# Altium schematic sheet Adafruit PyGamer_0.SchDoc: Adafruit PyGamer
size 456 x 289 mm; COMPANY: ADAFRUIT INDUSTRIES; DRAWN: KTOWN; REV: B; Origin: Eagle; Date: 7/14/2023 9:01:12 AM; SheetNumber: 1; GateName_1: G$1; SymbolName_1: FRAME_A3_ADAFRUIT; LibraryName: microbuilder; DeviceSetName: FRAME_A3_ADAFRUIT; Sheet: Sheet:; AdafruitIndustries: Adafruit Industries
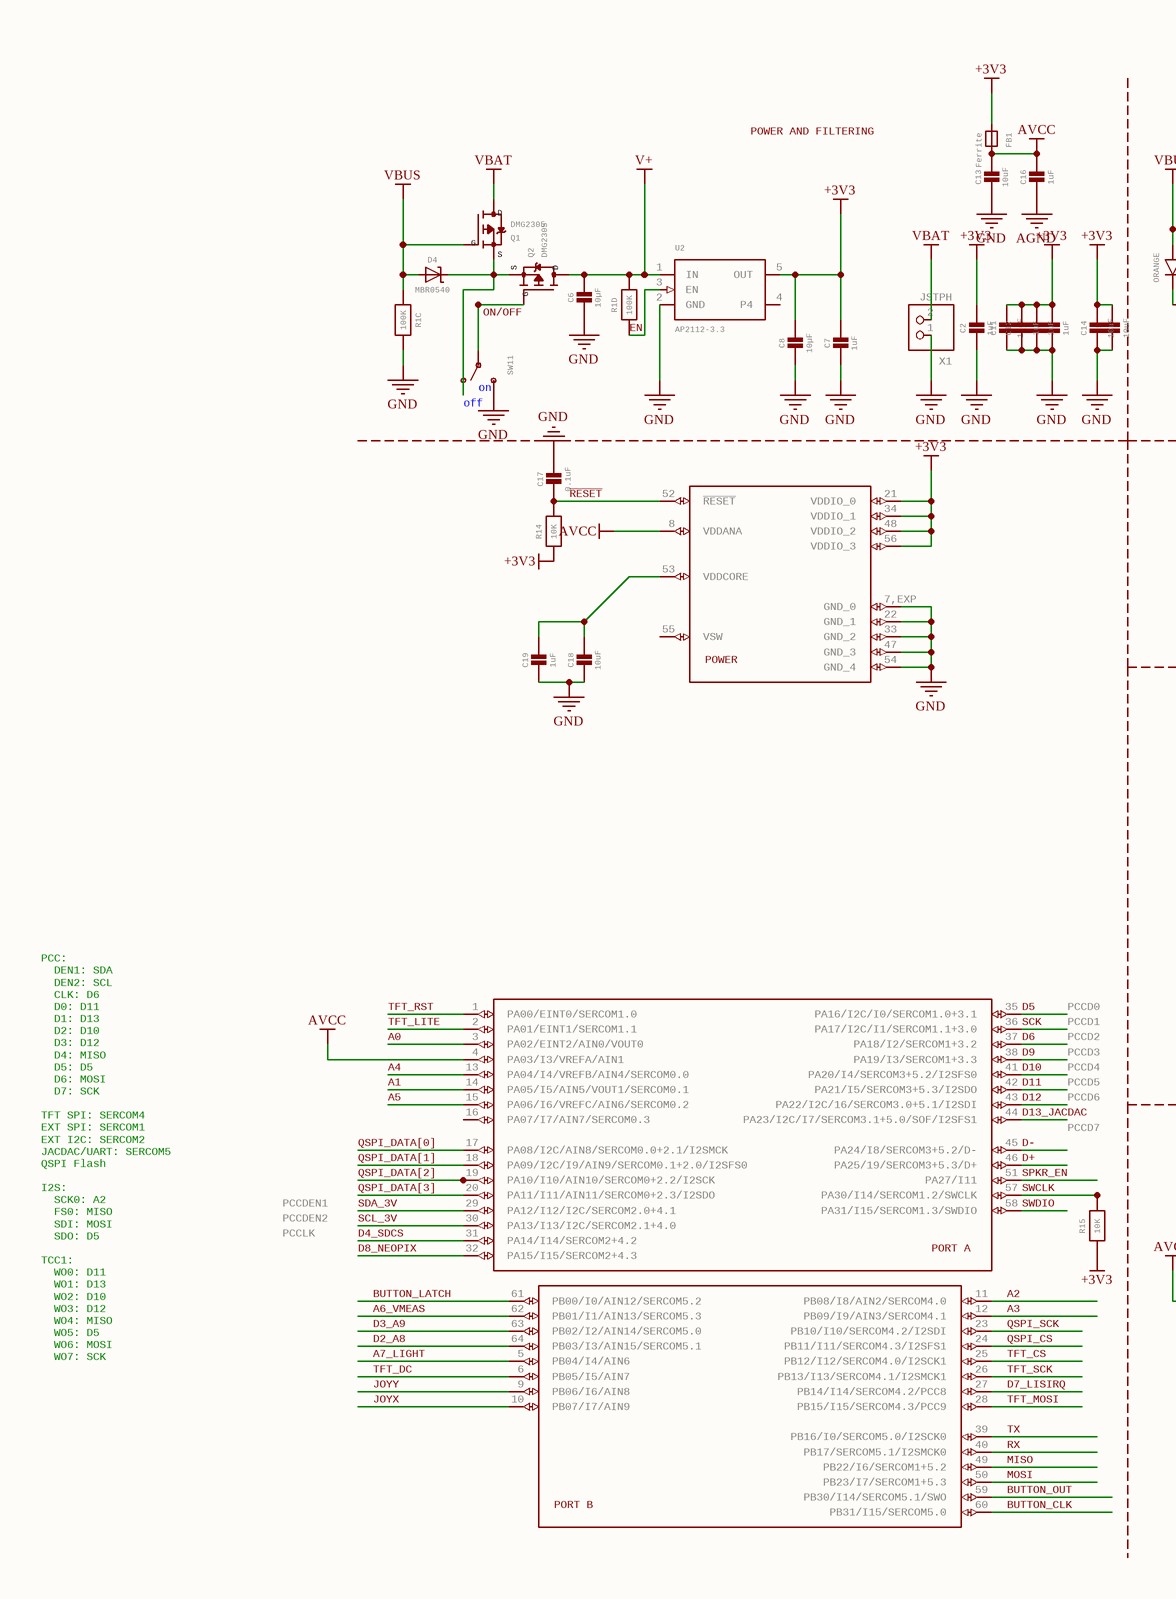
[diagram p0: Adafruit PyGamer_0.SchDoc, left]
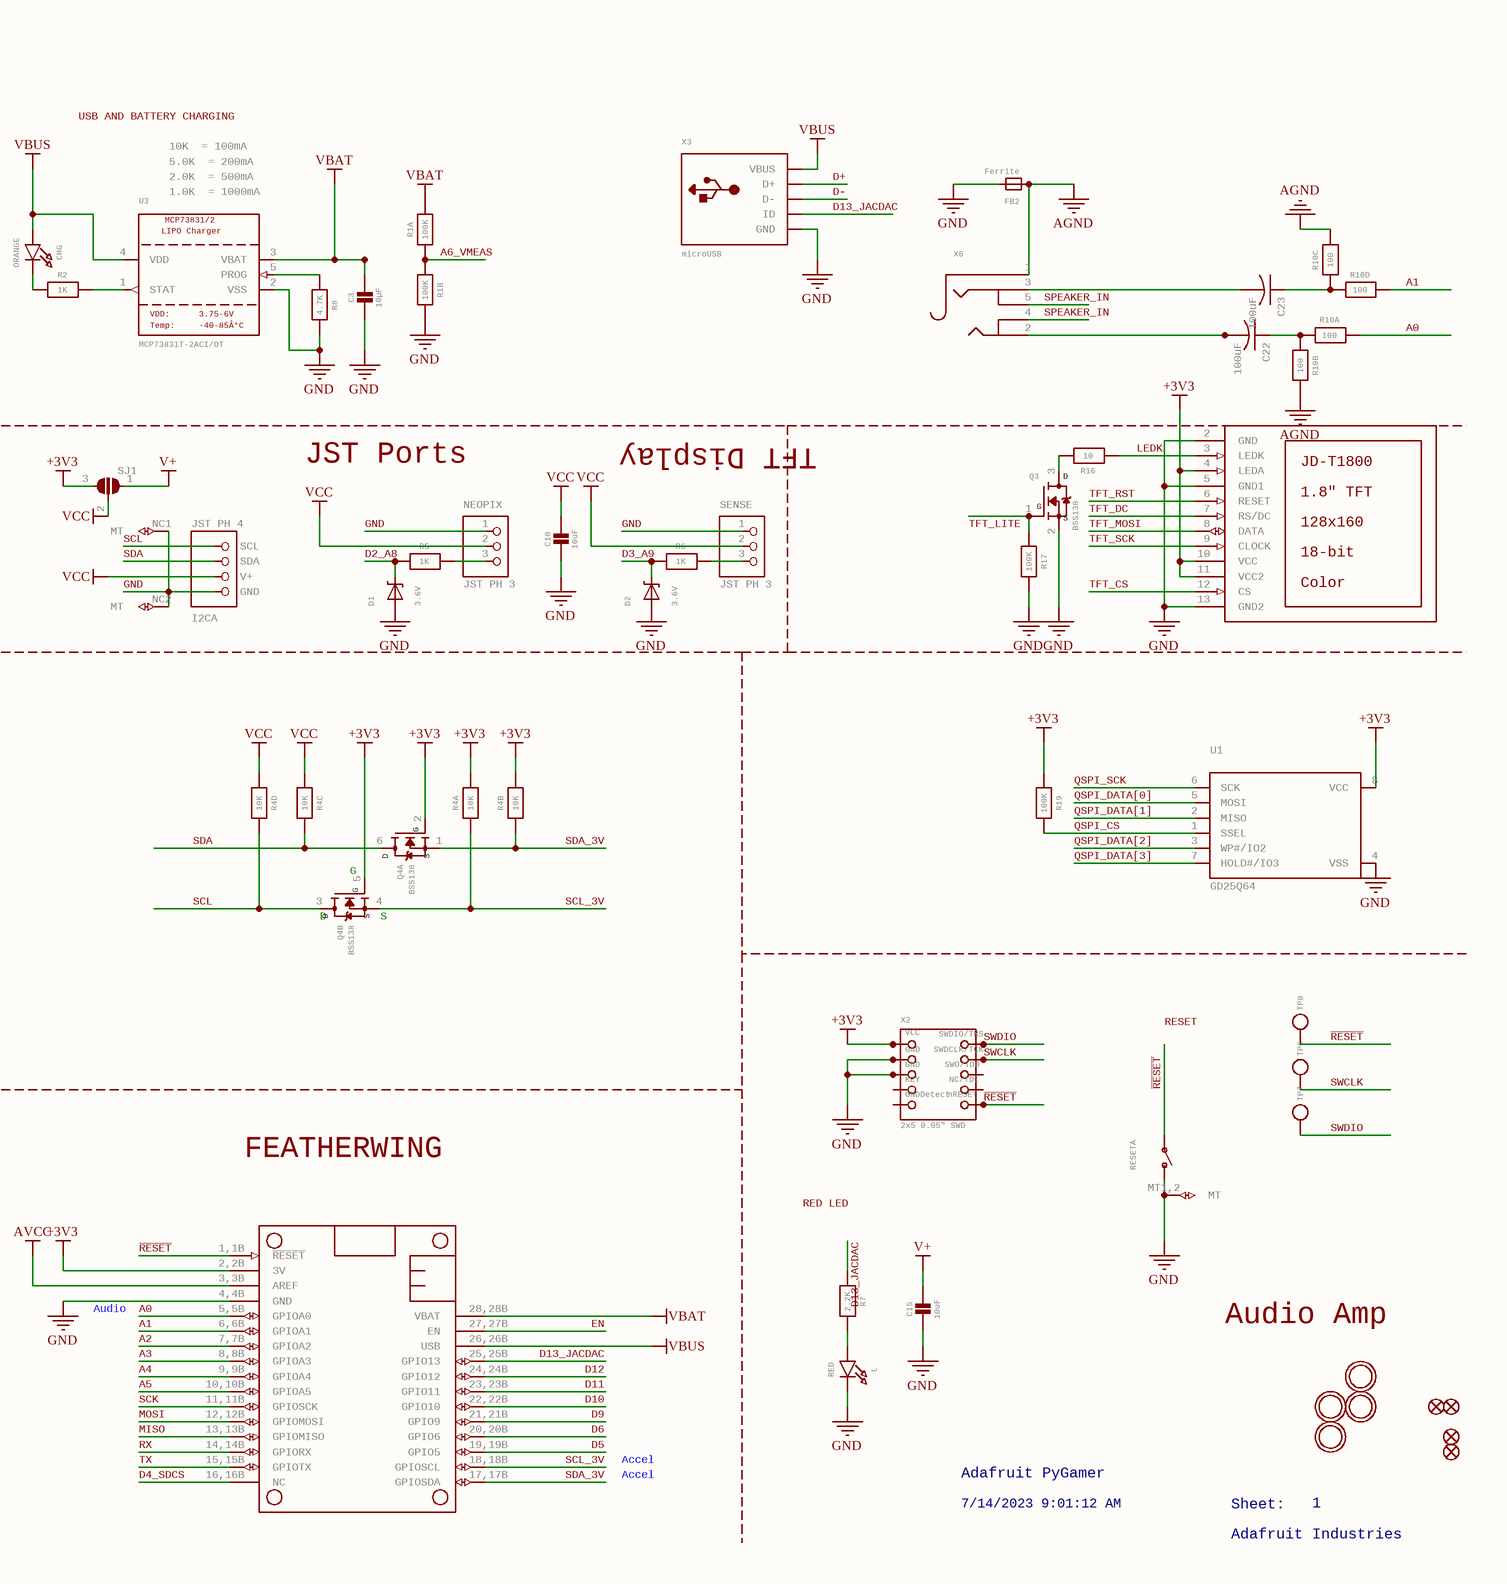
[diagram p1: Adafruit PyGamer_0.SchDoc, right]

## Parts
C1  1uF  [0603-NO]
C2  1uF  [0603-NO]
C3  10µF  [0805-NO]
C4  1uF  [0603-NO]
C5  10uF  [0805-NO]
C6  10µF  [0805-NO]
C7  1uF  [0603-NO]
C8  10µF  [0805-NO]
C10  10uF  [0805-NO]
C11  10uF  [0805-NO]
C12  1uF  [0603-NO]
C13  10uF  [0805-NO]
C14  10uF  [0805-NO]
C15  10uF  [0805-NO]
C16  1uF  [0603-NO]
C17  0.1uF  [0603-NO]
C18  10uF  [0805-NO]
C19  1uF  [0603-NO]
C22  100uF  [C1210]
C23  100uF  [C1210]
CHG  ORANGE  [CHIPLED_0805_NOOUTLINE]
D1  3.6V  [SOD-323]
D2  3.6V  [SOD-323]
D4  MBR0540  [SOD-123]
FB1  Ferrite  [0805-NO]
FB2  Ferrite  [_0805MP]
I2C  JST PH 4  [JSTPH4]  (parts A,B,C of 3)
L  RED  [CHIPLED_0805_NOOUTLINE]
LCD1  1.8"TFT: 1.8" TFT  [JD-T1800]  (hidden comment: DISP_LCD_JDT1800)
MS1  FEATHERWING_SMTDUALNOHOLES  [FEATHERWING_SMT_NOHOLES]  (value not drawn)
NEOPIX  JST PH 3  [JSTPH3]
Q1  DMG2305  [SOT23-R]
Q2  DMG2305  [SOT23-R]
Q3  BSS138  [SOT23-WIDE]
Q4  BSS138  [SOT363]  (parts A,B of 2)
R1  100K  [RESPACK_4X0603]  (parts A,B,C,D of 4)
R2  1K  [0603-NO]
R4  10K  [RESPACK_4X0603]  (parts A,B,C,D of 4)
R5  1K  [0603-NO]
R6  1K  [0603-NO]
R7  2.2K  [0603-NO]
R8  4.7K  [0603-NO]
R10  100  [RESPACK_4X0603]  (parts A,B,C,D of 4)
R14  10K  [0603-NO]
R15  10K  [0603-NO]
R16  10  [0603-NO]
R17  100K  [0603-NO]
R19  100K  [0603-NO]
RESET  SWITCH_SPST_TACT_RA  [SPST_TACTILE_RA]  (value not drawn)  (parts A,B of 2)
SENSE  JST PH 3  [JSTPH3]
SJ1  SOLDERJUMPER_2WAY  [SOLDERJUMPER_2WAY_OPEN_NOPASTE]  (value not drawn)
SW11  SWITCH_SPDT  [SPDT_SMT_SSSS811101]  (value not drawn)
TP6  TESTPOINTROUND2MMNO  [TESTPOINT_ROUND_2MM_NO]  (value not drawn)
TP7  TESTPOINTROUND2MMNO  [TESTPOINT_ROUND_2MM_NO]  (value not drawn)
TP8  TESTPOINTROUND2MMNO  [TESTPOINT_ROUND_2MM_NO]  (value not drawn)
U1  GD25Q64  [SOIC8_208MIL]
U2  AP2112-3.3  [SOT23-5]
U3  MCP73831T-2ACI/OT  LIPOCharger: LIPO Charger  Temp: Temp:  VDD: VDD:  [SOT23-5]
U$5  MOUNTINGHOLE3.0THIN  [MOUNTINGHOLE_3.0_PLATEDTHIN]  (value not drawn)
U$6  MOUNTINGHOLE3.0THIN  [MOUNTINGHOLE_3.0_PLATEDTHIN]  (value not drawn)
U$17  MOUNTINGHOLE3.0THIN  [MOUNTINGHOLE_3.0_PLATEDTHIN]  (value not drawn)
U$18  MOUNTINGHOLE3.0THIN  [MOUNTINGHOLE_3.0_PLATEDTHIN]  (value not drawn)
U$24  PORTA: PORT A  [PQFN64-1]  (hidden comment: ATSAMD51J19)  (parts A,B,C of 3)
U$34  FIDUCIAL_1MM  [FIDUCIAL_1MM]  (value not drawn)
U$35  FIDUCIAL_1MM  [FIDUCIAL_1MM]  (value not drawn)
U$43  FIDUCIAL_1MM  [FIDUCIAL_1MM]  (value not drawn)
U$46  FIDUCIAL_1MM  [FIDUCIAL_1MM]  (value not drawn)
X1  JSTPH  [JSTPH2]
X2  2x5 0.05" SWD  [2X05_1.27MM_BOX_POSTS]
X3  microUSB  [4UCONN_20329_V2]
X6  AUDIO_3.5MMJACK  [4UCONN_19269]  (value not drawn)

## Nets
+3V3: C1.1 C2.1 C4.1 C5.1 C7.1 C8.1 C11.1 C12.1 C14.1 FB1.1(P$1) LCD1.4(LEDA) LCD1.10(VCC) LCD1.11(VCC2) MS1.2,2B(3V) Q4.2(G) Q4.5(G) R4.1 R4.2 R14.1 R15.1 R19.1 SJ1.3 U1.8(VCC) U2.5(OUT) U$24.21(VDDIO_0) U$24.34(VDDIO_1) U$24.48(VDDIO_2) U$24.56(VDDIO_3) X2.1(VCC)
AGND: C16.2 FB2.1(P$1) R10.6 R10.7 X6.1(P$1)
AVCC: C13.1 C16.1 FB1.2(P$2) MS1.3,3B(AREF) U$24.4(PA03/I3/VREFA/AIN1) U$24.8(VDDANA)
GND: C1.2 C2.2 C3.2 C4.2 C5.2 C6.2 C7.2 C8.2 C10.2 C11.2 C12.2 C13.2 C14.2 C15.2 C17.1 C18.2 C19.2 D1.A D2.A FB2.2(P$2) I2C.1(GND) I2C.NC1(MT) I2C.NC2(MT) L.C LCD1.2(GND) LCD1.3(LEDK) LCD1.5(GND1) LCD1.13(GND2) MS1.4,4B(GND) NEOPIX.1 Q3.2(S) R1.6 R1.7 R8.2 R16.1 R17.2 RESET.2(S) RESET.MT1,2(MT) SENSE.1 SW11.C(S) U1.4(VSS) U2.2(GND) U3.2(VSS) U$24.7,EXP(GND_0) U$24.22(GND_1) U$24.33(GND_2) U$24.47(GND_3) U$24.54(GND_4) X1.1 X2.3(GND) X2.5(GND) X3.BASE@1,BASE@2,GND,SPRT@1,SPRT@2,SPRT@3,SPRT@4(GND)  [also labelled LEDK]
V+: C6.1 C15.1 Q2.3(D) R1.5 SJ1.1 U2.1(IN)
VBAT: C3.1 MS1.28,28B(VBAT) Q1.3(D) R1.8 U3.3(VBAT) X1.2
VBUS: CHG.A D4.A MS1.26,26B(USB) Q1.1(G) R1.3 U3.4(VDD) X3.VBUS
VCC: C10.1 I2C.2(V+) NEOPIX.2 R4.3 R4.4 SENSE.2 SJ1.2
A0: MS1.5,5B(GPIOA0) R10.8 U$24.3(PA02/EINT2/AIN0/VOUT0)
A1: MS1.6,6B(GPIOA1) R10.5 U$24.14(PA05/I5/AIN5/VOUT1/SERCOM0.1)
A2: MS1.7,7B(GPIOA2) U$24.11(PB08/I8/AIN2/SERCOM4.0)
A3: MS1.8,8B(GPIOA3) U$24.12(PB09/I9/AIN3/SERCOM4.1)
A4: MS1.9,9B(GPIOA4) U$24.13(PA04/I4/VREFB/AIN4/SERCOM0.0)
A5: MS1.10,10B(GPIOA5) U$24.15(PA06/I6/VREFC/AIN6/SERCOM0.2)
A6_VMEAS: R1.1 R1.2 U$24.62(PB01/I1/AIN13/SERCOM5.3)
A7_LIGHT: U$24.5(PB04/I4/AIN6)
BUTTON_CLK: U$24.60(PB31/I15/SERCOM5.0)
BUTTON_LATCH: U$24.61(PB00/I0/AIN12/SERCOM5.2)
BUTTON_OUT: U$24.59(PB30/I14/SERCOM5.1/SWO)
D2_A8: D1.C R5.2 U$24.64(PB03/I3/AIN15/SERCOM5.1)
D3_A9: D2.C R6.2 U$24.63(PB02/I2/AIN14/SERCOM5.0)
D4_SDCS: MS1.16,16B(NC) U$24.31(PA14/I14/SERCOM2+4.2)
D5: MS1.19,19B(GPIO5) U$24.35(PA16/I2C/I0/SERCOM1.0+3.1)
D6: MS1.20,20B(GPIO6) U$24.37(PA18/I2/SERCOM1+3.2)
D7_LISIRQ: U$24.27(PB14/I14/SERCOM4.2/PCC8)
D8_NEOPIX: U$24.32(PA15/I15/SERCOM2+4.3)
D9: MS1.21,21B(GPIO9) U$24.38(PA19/I3/SERCOM1+3.3)
D10: MS1.22,22B(GPIO10) U$24.41(PA20/I4/SERCOM3+5.2/I2SFS0)
D11: MS1.23,23B(GPIO11) U$24.42(PA21/I5/SERCOM3+5.3/I2SDO)
D12: MS1.24,24B(GPIO12) U$24.43(PA22/I2C/16/SERCOM3.0+5.1/I2SDI)
D13_JACDAC: MS1.25,25B(GPIO13) R7.1 U$24.44(PA23/I2C/I7/SERCOM3.1+5.0/SOF/I2SFS1) X3.ID
D+: U$24.46(PA25/19/SERCOM3+5.3/D+) X3.D+
D-: U$24.45(PA24/I8/SERCOM3+5.2/D-) X3.D-
EN: MS1.27,27B(EN) R1.4 U2.3(EN)
JOYX: U$24.10(PB07/I7/AIN9)
JOYY: U$24.9(PB06/I6/AIN8)
MISO: MS1.13,13B(GPIOMISO) U$24.49(PB22/I6/SERCOM1+5.2)
MOSI: MS1.12,12B(GPIOMOSI) U$24.50(PB23/I7/SERCOM1+5.3)
ON/OFF: Q2.1(G) SW11.B(P)
QSPI_CS: R19.2 U1.1(SSEL) U$24.24(PB11/I11/SERCOM4.3/I2SFS1)
QSPI_DATA[0]: U1.5(MOSI) U$24.17(PA08/I2C/AIN8/SERCOM0.0+2.1/I2SMCK)
QSPI_DATA[1]: U1.2(MISO) U$24.18(PA09/I2C/I9/AIN9/SERCOM0.1+2.0/I2SFS0)
QSPI_DATA[2]: U1.3(WP#/IO2) U$24.19(PA10/I10/AIN10/SERCOM0+2.2/I2SCK)
QSPI_DATA[3]: U1.7(HOLD#/IO3) U$24.20(PA11/I11/AIN11/SERCOM0+2.3/I2SDO)
QSPI_SCK: U1.6(SCK) U$24.23(PB10/I10/SERCOM4.2/I2SDI)
~{RESET}: C17.2 MS1.1,1B(~{RESET}) R14.2 RESET.1(P) TP8.P$1 U$24.52(~{RESET}) X2.10(NRESET)
RX: MS1.14,14B(GPIORX) U$24.40(PB17/SERCOM5.1/I2SMCK0)
SCK: MS1.11,11B(GPIOSCK) U$24.36(PA17/I2C/I1/SERCOM1.1+3.0)
SCL: I2C.4(SCL) Q4.3(D) R4.5
SCL_3V: MS1.18,18B(GPIOSCL) Q4.4(S) R4.8 U$24.30(PA13/I13/I2C/SERCOM2.1+4.0)
SDA: I2C.3(SDA) Q4.6(D) R4.6
SDA_3V: MS1.17,17B(GPIOSDA) Q4.1(S) R4.7 U$24.29(PA12/I12/I2C/SERCOM2.0+4.1)
SPEAKER_IN: X6.4(P$4) X6.5(P$3)
SPKR_EN: U$24.51(PA27/I11)
SWCLK: R15.2 TP6.P$1 U$24.57(PA30/I14/SERCOM1.2/SWCLK) X2.4(SWDCLK)
SWDIO: TP7.P$1 U$24.58(PA31/I15/SERCOM1.3/SWDIO) X2.2(SWDIO)
TFT_CS: LCD1.12(CS) U$24.25(PB12/I12/SERCOM4.0/I2SCK1)
TFT_DC: LCD1.7(RS/DC) U$24.6(PB05/I5/AIN7)
TFT_LITE: Q3.1(G) R17.1 U$24.2(PA01/EINT1/SERCOM1.1)
TFT_MOSI: LCD1.8(DATA) U$24.28(PB15/I15/SERCOM4.3/PCC9)
TFT_RST: LCD1.6(RESET) U$24.1(PA00/EINT0/SERCOM1.0)
TFT_SCK: LCD1.9(CLOCK) U$24.26(PB13/I13/SERCOM4.1/I2SMCK1)
TX: MS1.15,15B(GPIOTX) U$24.39(PB16/I0/SERCOM5.0/I2SCK0)
NetC18_1: C18.1 C19.1 U$24.53(VDDCORE)
NetC22_1: C22.1 R10.1 R10.2
NetC22_2: C22.2 X6.2(P$5)
NetC23_1: C23.1 R10.3 R10.4
NetC23_2: C23.2 X6.3(P$2)
NetCHG_C: CHG.C R2.1
NetD4_C: D4.C Q1.2(S) Q2.2(S) SW11.A(O)
NetL_A: L.A R7.2
NetNEOPIX_3: NEOPIX.3 R5.1
NetQ3_3: Q3.3(D) R16.2
NetR2_2: R2.2 U3.1(STAT)
NetR6_1: R6.1 SENSE.3
NetR8_1: R8.1 U3.5(PROG)

Not connected (* = marked no-connect by the designer): U2 4(P4); U$24 16(PA07/I7/AIN7/SERCOM0.3) 55(VSW); X2 6(SWO) 7(KEY) 8(TDI) 9(GNDDETECT)

## Notes on the sheet
- POWER AND FILTERING
- USB AND BATTERY CHARGING
- 10K  = 100mA
- 5.0K  = 200mA
- 2.0K  = 500mA
- 1.0K  = 1000mA
- (near SW11) off
- (near SW11) on
- TFT Display
- JST Ports
- (near Q4) G
- (near Q4) D
- (near Q4) S
- PCCD0
- PCCD1
- PCCD2
- PCCD3
- RESET
- PCCD4
- PCCD5
- PCCD6
- PCCD7
- PCCDEN1
- FEATHERWING
- PCCDEN2
- PCCLK
- RED LED
- PCC:
  DEN1: SDA
  DEN2: SCL
  CLK: D6
  D0: D11
  D1: D13
  D2: D10
  D3: D12
  D4: MISO
  D5: D5
  D6: MOSI
  D7: SCK
  TFT SPI: SERCOM4
  EXT SPI: SERCOM1
  EXT I2C: SERCOM2
  JACDAC/UART: SERCOM5
  QSPI Flash
  I2S:
  SCK0: A2
  FS0: MISO
  SDI: MOSI
  SDO: D5
  TCC1:
  WO0: D11
  WO1: D13
  WO2: D10
  WO3: D12
  WO4: MISO
  WO5: D5
  WO6: MOSI
  WO7: SCK
- Audio
- (near U$17) Audio Amp
- Accel
- Adafruit PyGamer
- 7/14/2023 9:01:12 AM
- Sheet:
- Adafruit Industries
- 1

## Library data of the parts
C1 C2 C4 C7 C12 C16 C17 C19 = CAP_CERAMIC0603_NO: Ceramic Capacitors   For new designs, use the packages preceded by an '_' character since they are more reliable:   The following footprints should be used on most boards: _0402 - Standard footprint for regular board layouts  _0603 - Standard footprint for regular board layouts  _0805 - Standard footprint for regular board layouts  _1206 - Standard footprint for regular board layouts       For extremely tight-pitch boards where space is at a premium, the following 'micro-pitch' footprints can be used (smaller pads, no silkscreen outline, etc.): _0402MP - Micro-pitch footprint for very dense/compact boards  _0603MP - Micro-pitch footprint for very dense/compact boards  _0805MP - Micro-pitch footprint for very dense/compact boards  _1206MP - Micro-pitch footprint for very dense/compact boards; GateName_1: G$1; SymbolName_1: CAPACITOR; DeviceName: 0603_NO; LibraryName: microbuilder; DeviceSetName: CAP_CERAMIC
C3 C5 C6 C8 C10 C11 C13-C15 C18 = CAP_CERAMIC0805-NOOUTLINE: Ceramic Capacitors   For new designs, use the packages preceded by an '_' character since they are more reliable:   The following footprints should be used on most boards: _0402 - Standard footprint for regular board layouts  _0603 - Standard footprint for regular board layouts  _0805 - Standard footprint for regular board layouts  _1206 - Standard footprint for regular board layouts       For extremely tight-pitch boards where space is at a premium, the following 'micro-pitch' footprints can be used (smaller pads, no silkscreen outline, etc.): _0402MP - Micro-pitch footprint for very dense/compact boards  _0603MP - Micro-pitch footprint for very dense/compact boards  _0805MP - Micro-pitch footprint for very dense/compact boards  _1206MP - Micro-pitch footprint for very dense/compact boards; GateName_1: G$1; SymbolName_1: CAPACITOR; DeviceName: 0805-NOOUTLINE; LibraryName: microbuilder; DeviceSetName: CAP_CERAMIC
  C8: REV: C
C22 C23 = C-USC1210: CAPACITOR, American symbol; GateName_1: G$1; SymbolName_1: C-US-1; DeviceSetName: C-US; DeviceName: C1210; LibraryName: resistor
CHG L = LED0805_NOOUTLINE: LED0603 - 0603 Surface Mount Package    2mA: Green LED - Low Power (3.9mcd, 2ma, 1.7Vf) - Digikey: 475-2709-2-ND  Orange LED - Low Power (9.8mcd, 2ma, 1.8Vf) - Digikey: 475-1194-2-ND  Red LED - Low Power (5mcd, 2ma, 1.8Vf) - Digikey: 475-1195-2-ND  Yellow LED - Low Power (7mcd, 2ma, 1.8Vf) - Digikey: 475-1196-2-ND       5mA: Blue LED - Low Power (17mcd, 5ma, 2.9Vf) - Digikey: LNJ937W8CRACT-ND    0805 - 0805 Surface Mount Package    2mA: Red LED (8.8mcd, 2mA, 1.8Vf, Clear) - Low Power [Digikey: 475-2510-1-ND]  Green LED (5mcd, 2mA, 1.8Vf, Clear) - Low Power [Digikey: 475-2730-1-ND]  Yellow LED (11.3mcd, 2mA, 1.8Vf, Clear) - Low Power [Digikey: 475-2555-1-ND]       20mA: Red LED (104mcd, 20mA, Diffused) - LS R976 [Digikey: 475-1278-6-ND]  Red LED (12mcd, 20mA, 2.0Vf, Clear) - APT2012EC [Digikey: 754-1128-1-ND]  Green LED (15mcd, 20mA, 2.2Vf, Clear) - APT2012GC [Digikey: 754-1131-1-ND]  Orange LED (160mcd, 20mA, 2.1Vf, Clear) - APT2012SECK [Digikey: 754-1130-1-ND]     1206 - 1206 Surface Mount Package  Green LED (26mcd, 20mA, Diffused) - LG N971  [Digikey: 475-1407-6-ND]  Red LED (15mcd, 20mA, Diffused) - LH N974 [Digikey: 475-1416-6-ND]     Cree - Cree High-Power Surface Mount LEDs  XPEBWT-L1-0000-00D50 - White 111lm 350mA 2.9Vf 6200K 110Â°  XTEAWT-00-0000-00000LEE3 - White 114lm 350mA 2.85Vf 5000K 115Â°     Everlight - Everlight 45-21 Series Surface Mount LEDs  45-21/QK2C-B2832AC2CB2/2T - Warm White 2000mcd 20mA 3.25Vf 3050K 120Â°  45-21/LK2C-B38452C4CB2/2T - Nuetral White 2000mcd 20mA 3.25Vf 4150K 120Â°  45-21/LK2C-B50634C6CB2/2T - Cold White 2200mcd 20mA 3.25Vf 5650K 120Â°     PLCC2 Reverse Mount LS T77K-J1L2-1-0-2-R18-Z - Red 11.25mcd 2mA 1.8Vf 630nm 120Â°  LO T77K-L1M2-24-Z - Orange 19.6mcd 2mA 1.8Vf 606nm 120Â°  LY T77K-K2M1-26-Z - Yellow 15.7mcd 2mA 1.8Vf 587nm 120Â°; GateName_1: G$1; SymbolName_1: LED; DeviceName: 0805_NOOUTLINE; LibraryName: microbuilder; DeviceSetName: LED
D1 D2 = DIODE-ZENERSOD323: Zener Diode   SMA: 30V 1W Zener Diode, 1.2Vf - Digikey: SMAZ30-FDICT-ND; GateName_1: G$1; DeviceName: SOD323; SymbolName_1: DIODE-ZENER; LibraryName: microbuilder; DeviceSetName: DIODE-ZENER
D4 = DIODE-SCHOTTKYSOD-123: GateName_1: G$1; SymbolName_1: DIODE-SCHOTTKY; DeviceName: SOD-123; LibraryName: microbuilder; DeviceSetName: DIODE-SCHOTTKY
FB1 = FERRITE-0805NO: Ferrite Bead   0603 MMZ1608B121C - 120 Ohm @ 100MHz, 600mA, 0.15 Ohm DC Resistance - Digikey: 445-2164-1-ND  BK1608HW121-T - 120 Ohm, 600mA Ferrite Chip - Digikey: 587-1876-2-ND       0805 HZ0805B272R-10 - 2.7K Ohm @ 100MHz, 200mA, 0.8 Ohm DC Resistance - Digikey: 240-2504-1-ND (see also Murata BLM21BD272SN1L)  MMZ2012Y152B - 1.5K Ohm @ 100MHz, 500mA, 0.4 Ohm DC Resistance - Digikey: 445-1560-1-ND - Mainly for high frequency (80-400MHz)  MMZ2012R102A - 1K Ohm @ 100MHz, 500mA, 0.3 Ohm DC Resistance - Digikey: 445-1555-2-ND - More general purpose (10-200MHz); GateName_1: G$1; SymbolName_1: FERRITE; DeviceName: -0805NO; LibraryName: microbuilder; DeviceSetName: FERRITE
FB2 = FERRITE_0805MP: Ferrite Bead   0603 MMZ1608B121C - 120 Ohm @ 100MHz, 600mA, 0.15 Ohm DC Resistance - Digikey: 445-2164-1-ND  BK1608HW121-T - 120 Ohm, 600mA Ferrite Chip - Digikey: 587-1876-2-ND       0805 HZ0805B272R-10 - 2.7K Ohm @ 100MHz, 200mA, 0.8 Ohm DC Resistance - Digikey: 240-2504-1-ND (see also Murata BLM21BD272SN1L)  MMZ2012Y152B - 1.5K Ohm @ 100MHz, 500mA, 0.4 Ohm DC Resistance - Digikey: 445-1560-1-ND - Mainly for high frequency (80-400MHz)  MMZ2012R102A - 1K Ohm @ 100MHz, 500mA, 0.3 Ohm DC Resistance - Digikey: 445-1555-2-ND - More general purpose (10-200MHz); GateName_1: G$1; SymbolName_1: FERRITE; DeviceName: _0805MP; LibraryName: microbuilder; DeviceSetName: FERRITE
I2C = STEMMA_I2C_RASMT: GateName_1: G$1; GateName_2: G$2; SymbolName_2: MOUNTING; GateName_3: G$3; DeviceName: _RASMT; SymbolName_1: STEMMA_I2C; SymbolName_3: MOUNTING; LibraryName: microbuilder; DeviceSetName: STEMMA_I2C
LCD1 = DISP_LCD_JDT1800: GateName_1: G$1; SymbolName_1: JD-T1800; LibraryName: microbuilder; DeviceSetName: DISP_LCD_JDT1800; JD-T1800: JD-T1800; 128x160: 128x160; 18-bit: 18-bit; Color: Color
MS1 = FEATHERWING_SMTDUALNOHOLES: GateName_1: G$1; SymbolName_1: MICROSHIELD; DeviceName: _SMTDUALNOHOLES; LibraryName: microbuilder; DeviceSetName: FEATHERWING
NEOPIX SENSE = CON_JST_PH_3PIN: GateName_1: G$1; SymbolName_1: PINHD3; LibraryName: microbuilder; DeviceSetName: CON_JST_PH_3PIN
Q1 Q2 = MOSFET-P: P-Channel Mosfet   LEGEND   VDS: Voltage Drain-Source ID: Drain Current RDS(ON): Drain-Source On-State Resistance VGS(TH): Gate-Source Threshold Voltage CISS: Drain-Source Input Capacitance    SOT-23   Name	VDS	ID	RDS(ON)	VGS(TH)	CISS	Order Number	   IRLML5103	30V	760mA	600 mOhm	--	75pF @ 25V	Digikey: IRLML5103PBFCT-ND	   IRLML6401	12V	4.3A	50 mOhm	950mV @ 250ÂµA	830pF @ 10V	Digikey: IRLML6401PBFTR-ND	   NTR0202PL	20V	400mA	800 mOhm	2.3V @ 250uA	70pF @ 5V	Digikey: NTR0202PLT1GOSTR-ND	   NTR4101PT1G	20V	1.8A	85 mOhm	1.2V @ 250uA	675pF @ 10V	Digikey: NTR4101PT1GOSCT-ND	   DMP2004K	20V	600mA	900 mOhm	1V @ 250uA	175pF @ 16V	Digikey: DMP2004KDICT-ND	   PMV65XP	20V	3.9A	76 mOhm	950mV @ 1mA	725pF @ 20V	Digikey: 568-2358-2-ND	   							   							TO-252   Name	VDS	ID	RDS(ON)	VGS(TH)	CISS	Order Number	   AOD417	30V	25A	34 mOhm	3V @ 250ÂµA	920pF @ 15V	Digikey: 785-1106-2-ND	PowerPak   Name	VDS	ID	RDS(ON)	VGS(TH)	CISS	Order Number	   AON7401	30V	12A	14 mOhm	3V @ 250ÂµA	2600pF @ 15V	Digikey: 785-1302-1-ND; GateName_1: G$1; SymbolName_1: MOSFET-P; LibraryName: microbuilder; DeviceSetName: MOSFET-P; D: D; S: S; G: G
Q3 = MOSFET-NWIDE: N-Channel Mosfet   LEGEND   VDS: Voltage Drain-Source ID: Drain Current RDS(ON): Drain-Source On-State Resistance VGS(TH): Gate-Source Threshold Voltage CISS: Drain-Source Input Capacitance    SOT-23   Name	VDS	ID	RDS(ON)	VGS(TH)	CISS	Order Number	   2N7002E	60V	260mA	2.5 Ohm	2.5V @ 250uA	26.7pF @ 25V	2N7002ET1GOSTR-ND	   BSH103	30V	850mA	400 mOhm	400mV @ 1mA	83pF @ 24V	BSH103,235-ND	   BSS138	60V	320mA	1.6 Ohm	1.5V @ 250uA	50pF @ 10V	Mouser: 771-BSS138PW115	   DMN2075U-7	20V	4.2A	38 mOhm	1V @ 250 uA	594.3pF @ 10V	DMN2075U-7DICT-ND	   							   * BSS138 good choice for I2C level-shifting   POWERPAK 1212-8   Name	VDS	ID	RDS(ON)	VGS(TH)	CISS	Order Number	   Si7308DN	60V	6A	58 mOhm	3V @ 250uA	665pF @ 15V	SI7308DN-T1-E3CT-ND; GateName_1: G$1; DeviceName: WIDE; SymbolName_1: MOSFET-N; LibraryName: microbuilder; DeviceSetName: MOSFET-N; D: D; S: S; G: G
Q4 = MOSFET-N_DUAL: Dual N-Channel MOSFET   SOT363 (2.0x1.25mm) 2N7002PS - 60V, 320mA [Digikey: 568-5984-1-ND]; GateName_1: 1; GateName_2: 2; SymbolName_1: MOSFET-N; SymbolName_2: MOSFET-N; LibraryName: microbuilder; DeviceSetName: MOSFET-N_DUAL; D: D; S: S; G: G
R1 R4 R10 = RESISTOR_4PACK: Resistor Packs (4 resistors)   4 x 0603 10K 1/16W - Digikey: YC164J-10KCT-ND; GateName_1: G$1; GateName_2: G$2; GateName_3: G$3; GateName_4: G$4; SymbolName_1: RESISTOR; SymbolName_2: RESISTOR; SymbolName_3: RESISTOR; SymbolName_4: RESISTOR; LibraryName: microbuilder; DeviceSetName: RESISTOR_4PACK
R2 R5-R8 R14-R17 R19 = RESISTOR_0603_NOOUT: Resistors   For new designs, use the packages preceded by an '_' character since they are more reliable:   The following footprints should be used on most boards: _0402 - Standard footprint for regular board layouts  _0603 - Standard footprint for regular board layouts  _0805 - Standard footprint for regular board layouts  _1206 - Standard footprint for regular board layouts       For extremely tight-pitch boards where space is at a premium, the following 'micro-pitch' footprints can be used (smaller pads, no silkscreen outline, etc.): _0402MP - Micro-pitch footprint for very dense/compact boards  _0603MP - Micro-pitch footprint for very dense/compact boards  _0805MP - Micro-pitch footprint for very dense/compact boards  _1206MP - Micro-pitch footprint for very dense/compact boards; GateName_1: G$1; SymbolName_1: RESISTOR; DeviceName: _0603_NOOUT; LibraryName: microbuilder; DeviceSetName: RESISTOR
RESET = SWITCH_SPST_TACT_RA: Switch - SPST 4UCon 19192 (6.7x2.6mm SMT); GateName_1: G$1; GateName_2: G$2; SymbolName_2: MOUNTING; SymbolName_1: SWITCH_SPST; DeviceName: _TACT_RA; LibraryName: microbuilder; DeviceSetName: SWITCH_SPST
SJ1 = SOLDERJUMPER_2WAY: 2-Way Solder Jumper; GateName_1: G$1; SymbolName_1: SOLDERJUMPER_2WAY; LibraryName: microbuilder; DeviceSetName: SOLDERJUMPER_2WAY
SW11 = SWITCH_SPDT: Switch - SPDT SSSS811101 - Horizontal Two Position SMT, 0.3A 4V [Mouser: 688-SSSS811101]; GateName_1: G$1; SymbolName_1: SWITCH_SPDT; LibraryName: microbuilder; DeviceSetName: SWITCH_SPDT
TP6-TP8 = TESTPOINTROUND2MMNO: Test Point   Various test points for characterisation and PCB testing    TESTPOINT_SMT - Compact Surface Mount Test Point [Digikey: 5016KTR-ND]; GateName_1: G$1; SymbolName_1: TESTPOINT; DeviceName: ROUND2MMNO; LibraryName: microbuilder; DeviceSetName: TESTPOINT
U1 = SPIFLASH_8PIN208MIL: SOIC8 SPI Flash   Be careful with the size since SOIC8 flash comes in several 'widths'   SOIC8 150 mil M25P16 - 16Mbit (2Mbit x 8) Serial Flash (75MHz SPI Bus), Supply: 2.7-3.6V  Digikey:  SOIC8 - M25P16-VMN6P-ND       SOIC8 208 mil W25Q16BVSSIG - 16Mbit (2Mbit x 8) Serial Flash (104MHz SPI Bus), Supply: 2.7-3.6V  Digikey:  SOIC8 - W25Q16BVSSIG-ND; GateName_1: G$1; DeviceName: 208MIL; SymbolName_1: M25P16; LibraryName: microbuilder; DeviceSetName: SPIFLASH_8PIN
U2 = VREG_SOT23-5: SOT23-5 Fixed Voltage Regulators      Part	Current Out	V Out	V In	V Dropout	Î¸JA (Â°C/W)	TJ (Â°C)	Digikey Part No.	     ADP121	  150mA	  3.3V	  3.4-5.5V	  0.09V @ 150mA	  --	  --	  ADP121-AUJZ33R7CT-ND	     ADP121	  150mA	  3.0V	  3.1-5.5V	  0.09V @ 150mA	  --	  --	  ADP121-AUJZ30R7CT-ND	     ADP122	  300mA	  3.3V	  3.4-5.5V	  0.085V @ 300mA	  --	  --	  ADP122AUJZ-3.3-R7CT-ND	     ADP1712	  300mA	  3.3V	  3.5-5.5V	  0.17V @ 300mA	  --	  --	  ADP1712AUJZ-3.3-R7TR-ND	     AP7311 (Low Cost)	  150mA	  3.3V	  3.5-6V	  0.15V @ 150mA	  --	  --	  AP7311-33WG-7DICT-ND	     LD39015M18R	  150mA	  1.8V	  1.9V-5.5V	  0.08V @ 100mA	  --	  --	  497-6977-1-ND	     LP2985A-33DBVR	  150mA	  3.3V	  3.3-16V	  0.28V @ 150mA	  206	  150	  296-18479-1-ND	     MCP1824T-3302E/OT	  300mA	  3.3V	  3.5V-6V	  0.2V @ 300mA	  --	  --	  MCP1824T-3302E/OTCT-ND	     MIC5205-2.5YM5 TR	  150mA	  2.5V	  2.7-16V	  0.165V @ 150mA	  --	  --	  576-1257-2-ND	     MIC5205-3.0YM5 TR	  150mA	  3.0V	  3.2V-16V	  0.165V @ 150mA	  --	  --	  576-1258-2-ND	     MIC5205-3.3YM5 TR	  150mA	  3.3V	  3.5V-16V	  0.165V @ 150mA	  --	  --	  576-1259-2-ND	     TPS780330220	  150mA	  3.3V+2.2V	  3.6-5.5V	  250mV Max	  --	  --	  296-23332-1-ND	     TDA3663/N1,135	  100mA	  3.3V	  3.5-45V	  0.18V @ 50mA	  --	  --	  568-5343-1-ND	     	  	  	  	  	  	  	  	     	  	  	  	  	  	  	  	   Max operating temp can be calculated using Î¸JA, TJ (max junction temperature), and power in watts.  Set the "Maximum Ambient Temperature" until it reaches TJ ("Max Junction Temperature"), which is the absolute limit for safe use of the regulator: Heat Sink Temperature Calculator   For example, With 12V source into a 3.3V LP2985 and a 30mA load, we are dissipating (12V-3.3V) * 0.03A = 0.261W.  With a Î¸JA of 206 Â°C/W, a TJ of 150Â°C, and 261mW we can safely use the chip without a heat sink up to 75Â°C (=147.1Â°C Junction Temperature).; GateName_1: G$1; SymbolName_1: VREG_SOT23-5; LibraryName: microbuilder; DeviceSetName: VREG_SOT23-5
U3 = MCP73831/2: MCP73831/2 LIPO Charger    VDD: 3.75 - 6V  Temp -40 - 85Â°C  Programmable Charge Rate: 15-500mA       NOTE: STAT is a tri-state logic output on the MCP73831 and an open-drain output on the MCP73832.   SOT23-5 with 4.2V output and tri-state logic on STAT = MCP73831T-2ACI/OT; GateName_1: G$1; SymbolName_1: MCP73831/2; LibraryName: microbuilder; DeviceSetName: MCP73831/2; MCP73831/2: MCP73831/2; -40-85Â°C: -40-85Â°C; 3.75-6V: 3.75-6V
U$5 U$6 U$17 U$18 = MOUNTINGHOLE3.0THIN: Mounting Hole   For #2 screws (0.086"/2.18mm width, 0.094"/2.4mm hole) use 2.5mm; GateName_1: G$1; BOM: EXCLUDE; SymbolName_1: MOUNTINGHOLE; DeviceName: 3.0THIN; LibraryName: microbuilder; DeviceSetName: MOUNTINGHOLE
U$24 = ATSAMD51J: ATSAMD51J cortex m4 microcontroller; GateName_1: G$1; SymbolName_1: ATSAMD51J_PORTA; GateName_2: G$2; SymbolName_2: ATSAMD51J_PORTB; GateName_3: G$3; SymbolName_3: ATSAMD51J_PWR; LibraryName: microbuilder; DeviceSetName: ATSAMD51J
U$34 U$35 U$43 U$46 = FIDUCIAL_1MM: Fiducial Alignment Points   Various fiducial points for machine vision alignment.; GateName_1: G$1; DeviceName: _1MM; BOM: EXCLUDE; SymbolName_1: FIDUCIAL; LibraryName: microbuilder; DeviceSetName: FIDUCIAL
X1 = CON_JST_PH_2PIN: JST 2-Pin Right-Angle Connector  PH-Series - 4UConnector: 17311  SH-Series - 4UConnector: 07278; GateName_1: G$1; SymbolName_1: PINHD2; LibraryName: microbuilder; DeviceSetName: CON_JST_PH_2PIN
X2 = JTAG-CORTEXBOXPOSTS: Serial Wire (SW-DP) Connector   Standard 0.05" 10-pin connector is for use with the Cortex M and Cortex A SWD (serial wire debugger) interface (SW-DP)Connectors 2x05_1.27MM_SMT - Inexpensive surface-mount header with bare pins, compatible with standard 10-pin SWD cables (4UCON: 16846)  2x05_1.27MM_BOX_NOPOSTS - Polarised surface-mount box (4UCON with caps: 19735, without caps: 15117  2x05_1.27MM_BOX_POSTS - Polarised surface-mount box with mounting holes (4UCON: 20317)    Pinout: http://infocenter.arm.com/help/topic/com.arm.doc.faqs/attached/13634/cortex_debug_connectors.pdf  http://www.keil.com/peripherals/coresight/connectors.asp; GateName_1: G$1; SymbolName_1: JTAG-CORTEX; DeviceName: BOXPOSTS; LibraryName: microbuilder; DeviceSetName: JTAG-CORTEX; nRESET: nRESET; NC/TDI: NC/TDI; SWO/TDO: SWO/TDO; SWDCLK/TCK: SWDCLK/TCK; SWDIO/TMS: SWDIO/TMS; VCC: VCC; GND: GND; KEY: KEY; GNDDetect: GNDDetect
X3 = USB_MICRO_20329_V2: USB ConnectorsUSBMINIB - Surface Mount Female Mini-B USB Connector    4UConnector: 06564; GateName_1: G$1; SymbolName_1: USB; DeviceName: _MICRO_20329_V2; LibraryName: microbuilder; DeviceSetName: USB
X6 = AUDIO_3.5MMJACK: 3.5MM Audio Jack   These are normally connected as follows, from left-to right on the schematic symbol above: Tip: Left Audio  Inner Ring: Right Audio  Shell: Common/GND; GateName_1: G$1; SymbolName_1: 3.5MMAUDIO_5PIN; LibraryName: microbuilder; DeviceSetName: AUDIO_3.5MMJACK